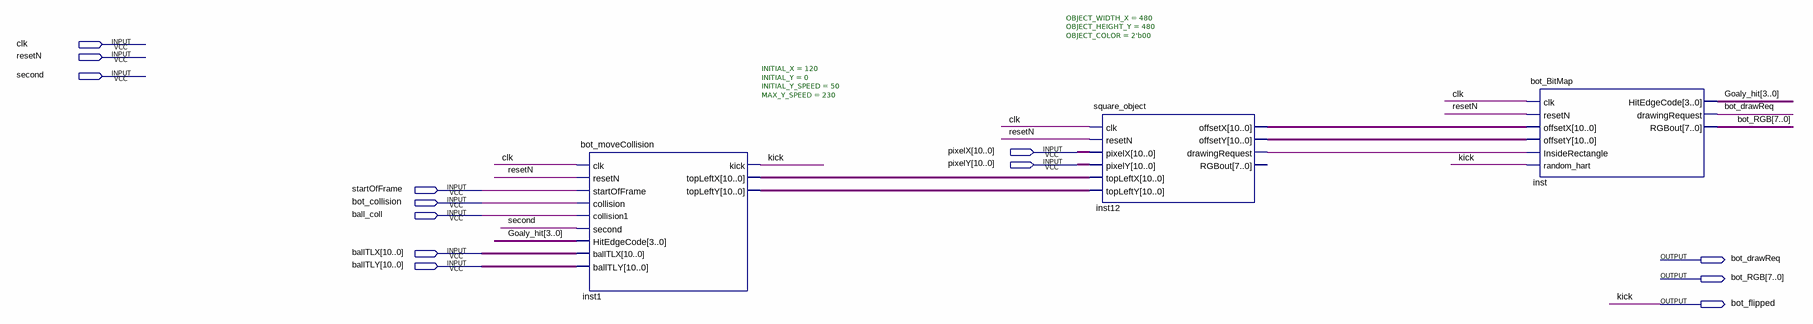
[diagram p0: schematic sheet]
// Quartus schematic bot_block.bdf as structural Verilog: 3 symbols, 13 pins
module bot_block (
  input  clk,
  input  resetN,
  input  second,
  input  [10:0] pixelX,
  input  [10:0] pixelY,
  input  startOfFrame,
  input  bot_collision,
  input  ball_coll,
  input  [10:0] ballTLX,
  input  [10:0] ballTLY,
  output bot_drawReq,
  output [7:0] bot_RGB,
  output bot_flipped
);

  wire inst12_drawingrequest;
  wire [3:0] Goaly_hit;
  wire [10:0] inst1_topleftx, inst1_toplefty, inst12_offsetx, inst12_offsety;

  bot_moveCollision #(.INITIAL_X(120), .INITIAL_Y(0), .INITIAL_Y_SPEED(50), .MAX_Y_SPEED(230)) inst1 (
    .clk(clk), .resetN(resetN), .startOfFrame(startOfFrame), .collision(bot_collision),
    .collision1(ball_coll), .second(second), .HitEdgeCode(Goaly_hit), .ballTLX(ballTLX), .ballTLY(ballTLY),
    .kick(bot_flipped), .topLeftX(inst1_topleftx), .topLeftY(inst1_toplefty));
  square_object #(.OBJECT_WIDTH_X(480), .OBJECT_HEIGHT_Y(480), .OBJECT_COLOR(2'b00)) inst12 (
    .clk(clk), .resetN(resetN), .pixelX(pixelX), .pixelY(pixelY), .topLeftX(inst1_topleftx),
    .topLeftY(inst1_toplefty), .offsetX(inst12_offsetx), .offsetY(inst12_offsety),
    .drawingRequest(inst12_drawingrequest));  // open: RGBout
  bot_BitMap inst (
    .clk(clk), .resetN(resetN), .offsetX(inst12_offsetx), .offsetY(inst12_offsety),
    .InsideRectangle(inst12_drawingrequest), .random_hart(bot_flipped), .HitEdgeCode(Goaly_hit),
    .drawingRequest(bot_drawReq), .RGBout(bot_RGB));

  // Other names for the same wires on the sheet: kick = bot_flipped
endmodule
